# Altium schematic sheet POWER_RK806.SchDoc (part 1 of 2)
size 840 x 594 mm; SheetNumber: 14; SheetTotal: 23
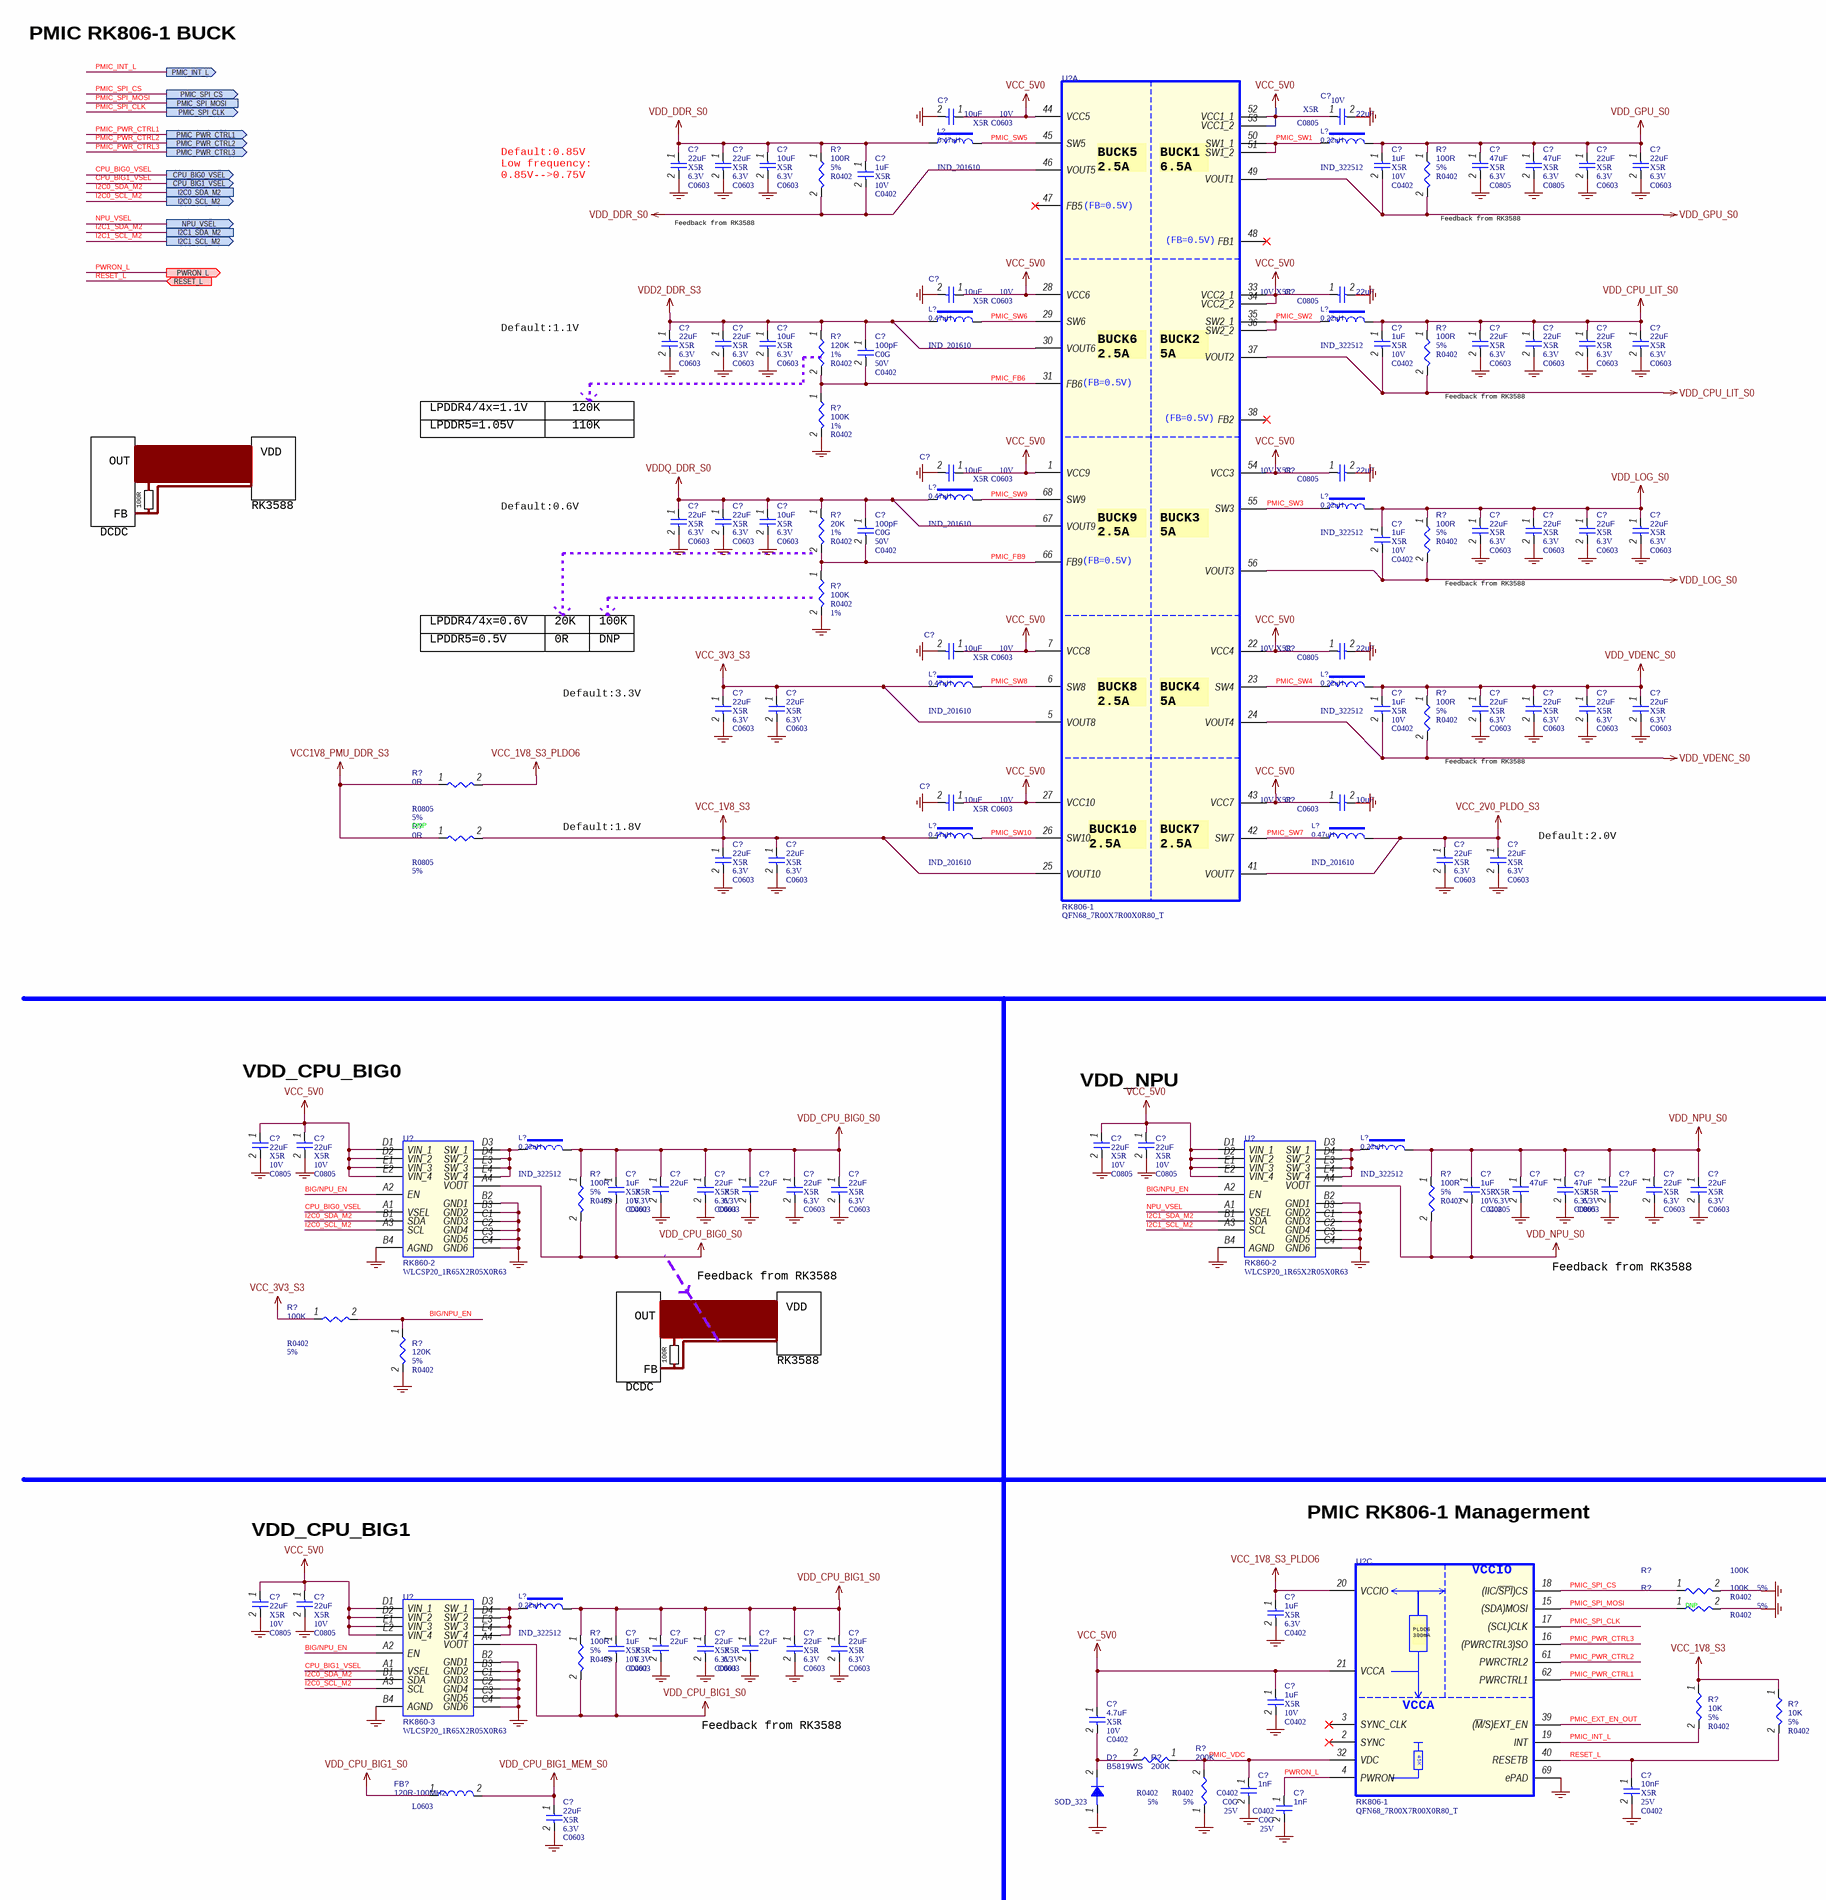
[diagram p0: POWER_RK806.SchDoc, left]
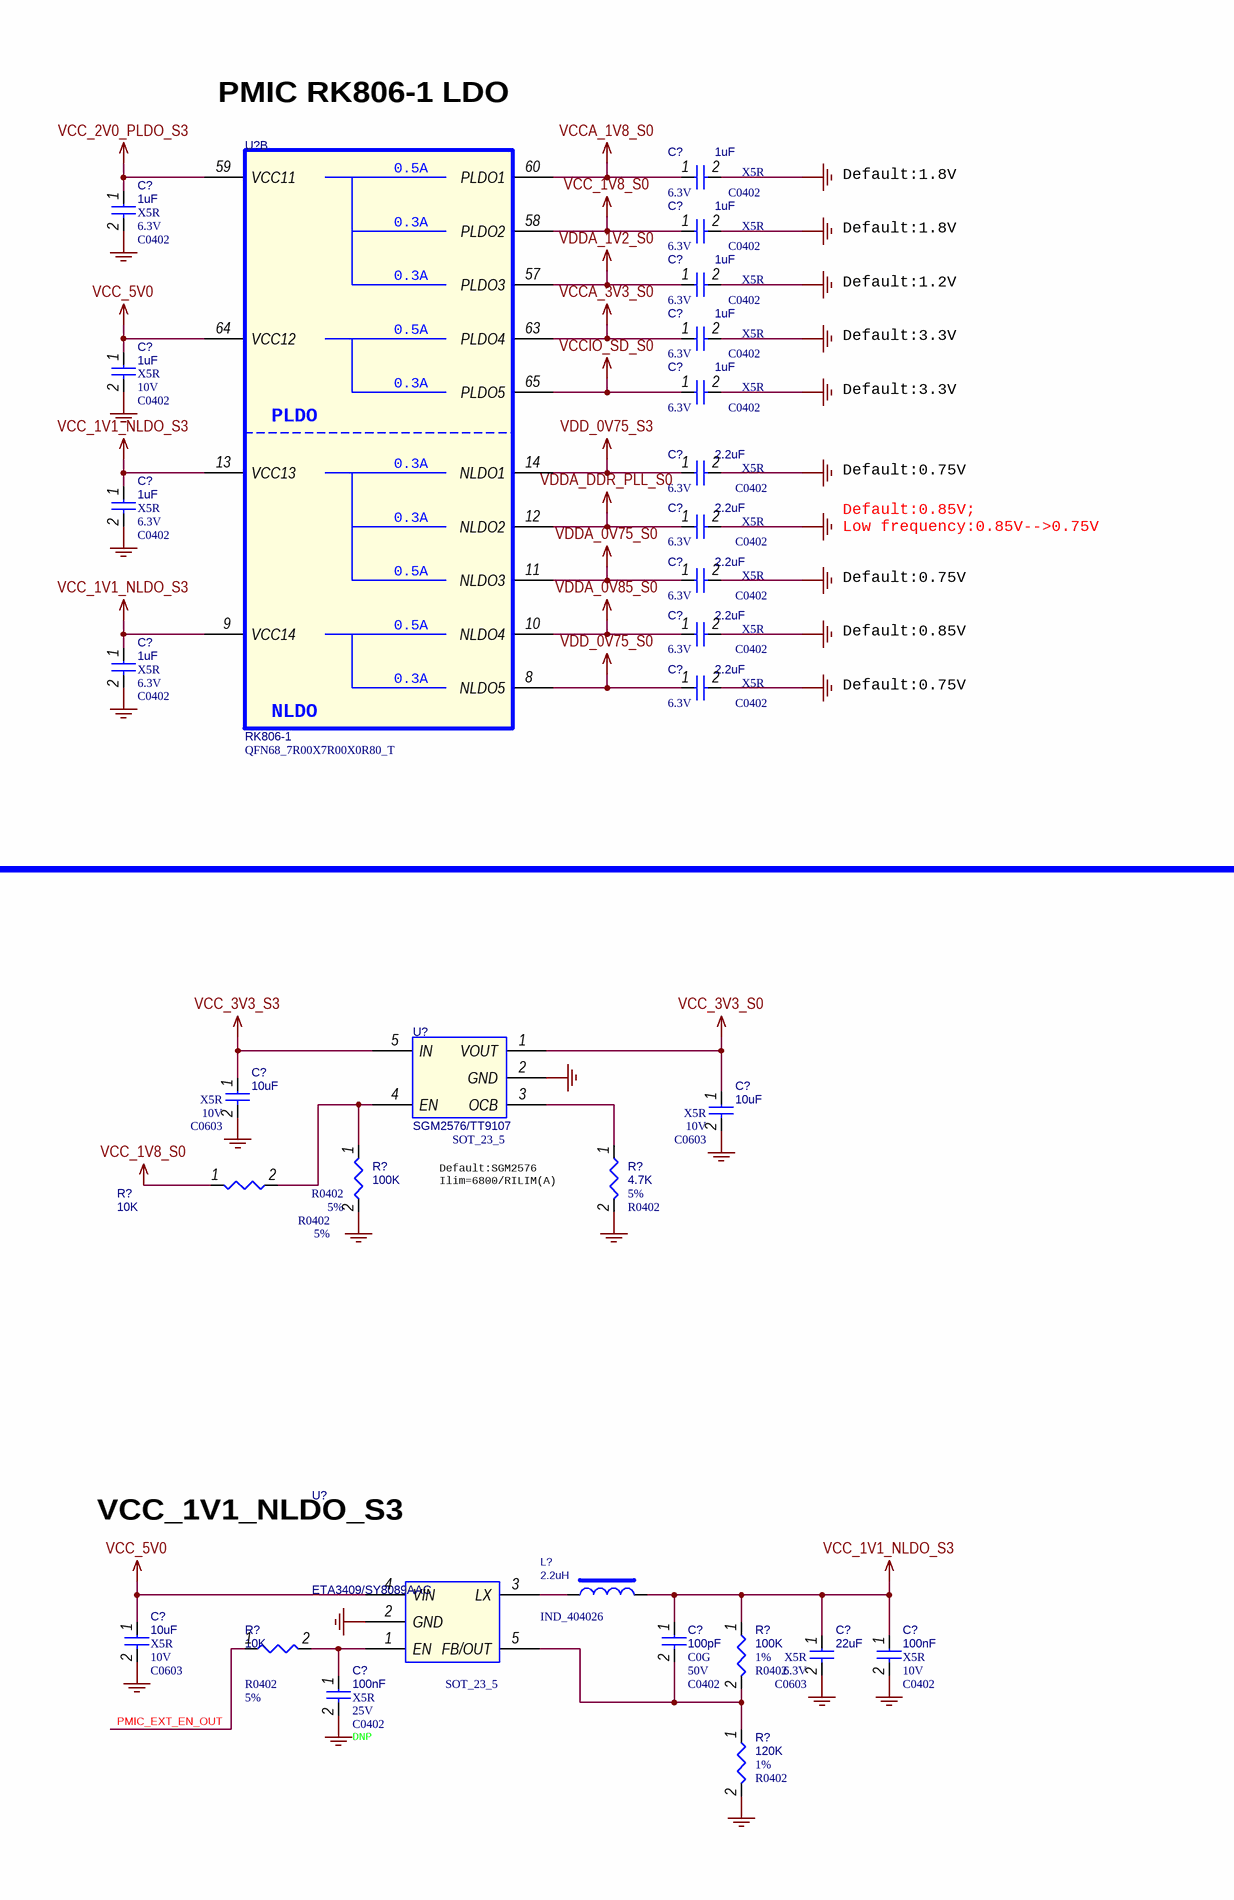
[diagram p1: POWER_RK806.SchDoc, right]

## Parts
(Parts that share a designator on the sheet are numbered #1, #2 ... from top to bottom, then left to right.)
C?#1  10uF  Dielectric: X5R  Voltage: 10V  [C0603]
C?#2  22uF  Dielectric: X5R  Voltage: 10V  [C0805]
C?#3  22uF  Dielectric: X5R  Voltage: 6.3V  [C0603]
C?#4  22uF  Dielectric: X5R  Voltage: 6.3V  [C0603]
C?#5  10uF  Dielectric: X5R  Voltage: 6.3V  [C0603]
C?#6  1uF  Dielectric: X5R  Voltage: 10V  [C0402]
C?#7  47uF  Dielectric: X5R  Voltage: 6.3V  [C0805]
C?#8  47uF  Dielectric: X5R  Voltage: 6.3V  [C0805]
C?#9  22uF  Dielectric: X5R  Voltage: 6.3V  [C0603]
C?#10  22uF  Dielectric: X5R  Voltage: 6.3V  [C0603]
C?#11  1uF  Dielectric: X5R  Voltage: 10V  [C0402]
C?#12  10uF  Dielectric: X5R  Voltage: 10V  [C0603]
C?#13  22uF  Dielectric: X5R  Voltage: 10V  [C0805]
C?#14  1uF  Dielectric: X5R  Voltage: 6.3V  [C0402]
C?#15  1uF  Dielectric: X5R  Voltage: 6.3V  [C0402]
C?#16  1uF  Dielectric: X5R  Voltage: 6.3V  [C0402]
C?#17  22uF  Dielectric: X5R  Voltage: 6.3V  [C0603]
C?#18  22uF  Dielectric: X5R  Voltage: 6.3V  [C0603]
C?#19  10uF  Dielectric: X5R  Voltage: 6.3V  [C0603]
C?#20  1uF  Dielectric: X5R  Voltage: 10V  [C0402]
C?#21  22uF  Dielectric: X5R  Voltage: 6.3V  [C0603]
C?#22  22uF  Dielectric: X5R  Voltage: 6.3V  [C0603]
C?#23  22uF  Dielectric: X5R  Voltage: 6.3V  [C0603]
C?#24  22uF  Dielectric: X5R  Voltage: 6.3V  [C0603]
C?#25  100pF  Dielectric: C0G  Voltage: 50V  [C0402]
C?#26  1uF  Dielectric: X5R  Voltage: 6.3V  [C0402]
C?#27  1uF  Dielectric: X5R  Voltage: 6.3V  [C0402]
C?#28  1uF  Dielectric: X5R  Voltage: 10V  [C0402]
C?#29  1uF  Dielectric: X5R  Voltage: 6.3V  [C0402]
C?#30  10uF  Dielectric: X5R  Voltage: 10V  [C0603]
C?#31  22uF  Dielectric: X5R  Voltage: 10V  [C0805]
C?#32  2.2uF  Dielectric: X5R  Voltage: 6.3V  [C0402]
C?#33  1uF  Dielectric: X5R  Voltage: 6.3V  [C0402]
C?#34  22uF  Dielectric: X5R  Voltage: 6.3V  [C0603]
C?#35  22uF  Dielectric: X5R  Voltage: 6.3V  [C0603]
C?#36  10uF  Dielectric: X5R  Voltage: 6.3V  [C0603]
C?#37  2.2uF  Dielectric: X5R  Voltage: 6.3V  [C0402]
C?#38  100pF  Dielectric: C0G  Voltage: 50V  [C0402]
C?#39  22uF  Dielectric: X5R  Voltage: 6.3V  [C0603]
C?#40  22uF  Dielectric: X5R  Voltage: 6.3V  [C0603]
C?#41  22uF  Dielectric: X5R  Voltage: 6.3V  [C0603]
C?#42  22uF  Dielectric: X5R  Voltage: 6.3V  [C0603]
C?#43  1uF  Dielectric: X5R  Voltage: 10V  [C0402]
C?#44  2.2uF  Dielectric: X5R  Voltage: 6.3V  [C0402]
C?#45  2.2uF  Dielectric: X5R  Voltage: 6.3V  [C0402]
C?#46  1uF  Dielectric: X5R  Voltage: 6.3V  [C0402]
C?#47  2.2uF  Dielectric: X5R  Voltage: 6.3V  [C0402]
C?#48  10uF  Dielectric: X5R  Voltage: 10V  [C0603]
C?#49  22uF  Dielectric: X5R  Voltage: 10V  [C0805]
C?#50  22uF  Dielectric: X5R  Voltage: 6.3V  [C0603]
C?#51  22uF  Dielectric: X5R  Voltage: 6.3V  [C0603]
C?#52  1uF  Dielectric: X5R  Voltage: 10V  [C0402]
C?#53  22uF  Dielectric: X5R  Voltage: 6.3V  [C0603]
C?#54  22uF  Dielectric: X5R  Voltage: 6.3V  [C0603]
C?#55  22uF  Dielectric: X5R  Voltage: 6.3V  [C0603]
C?#56  22uF  Dielectric: X5R  Voltage: 6.3V  [C0603]
C?#57  10uF  Dielectric: X5R  Voltage: 10V  [C0603]
C?#58  10uF  Dielectric: X5R  Voltage: 10V  [C0603]
C?#59  22uF  Dielectric: X5R  Voltage: 6.3V  [C0603]
C?#60  22uF  Dielectric: X5R  Voltage: 6.3V  [C0603]
C?#61  22uF  Dielectric: X5R  Voltage: 6.3V  [C0603]
C?#62  22uF  Dielectric: X5R  Voltage: 6.3V  [C0603]
C?#63  10uF  Dielectric: X5R  Voltage: 10V  [C0603]
C?#64  10uF  Dielectric: X5R  Voltage: 10V  [C0603]
C?#65  22uF  Dielectric: X5R  Voltage: 10V  [C0805]
C?#66  22uF  Dielectric: X5R  Voltage: 10V  [C0805]
C?#67  22uF  Dielectric: X5R  Voltage: 10V  [C0805]
C?#68  22uF  Dielectric: X5R  Voltage: 10V  [C0805]
C?#69  1uF  Dielectric: X5R  Voltage: 10V  [C0402]
C?#70  22uF  Dielectric: X5R  Voltage: 6.3V  [C0603]
C?#71  22uF  Dielectric: X5R  Voltage: 6.3V  [C0603]
C?#72  22uF  Dielectric: X5R  Voltage: 6.3V  [C0603]
C?#73  22uF  Dielectric: X5R  Voltage: 6.3V  [C0603]
C?#74  22uF  Dielectric: X5R  Voltage: 6.3V  [C0603]
C?#75  1uF  Dielectric: X5R  Voltage: 10V  [C0402]
C?#76  47uF  Dielectric: X5R  Voltage: 6.3V  [C0805]
C?#77  47uF  Dielectric: X5R  Voltage: 6.3V  [C0805]
C?#78  22uF  Dielectric: X5R  Voltage: 6.3V  [C0603]
C?#79  22uF  Dielectric: X5R  Voltage: 6.3V  [C0603]
C?#80  22uF  Dielectric: X5R  Voltage: 6.3V  [C0603]
C?#81  10uF  Dielectric: X5R  Voltage: 10V  [C0603]
C?#82  100pF  Dielectric: C0G  Voltage: 50V  [C0402]
C?#83  22uF  Dielectric: X5R  Voltage: 6.3V  [C0603]
C?#84  100nF  Dielectric: X5R  Voltage: 10V  [C0402]
C?#85  100nF  Dielectric: X5R  Voltage: 25V  Option: DNP  [C0402]
C?#86  22uF  Dielectric: X5R  Voltage: 10V  [C0805]
C?#87  22uF  Dielectric: X5R  Voltage: 10V  [C0805]
C?#88  1uF  Dielectric: X5R  Voltage: 6.3V  [C0402]
C?#89  1uF  Dielectric: X5R  Voltage: 10V  [C0402]
C?#90  22uF  Dielectric: X5R  Voltage: 6.3V  [C0603]
C?#91  22uF  Dielectric: X5R  Voltage: 6.3V  [C0603]
C?#92  22uF  Dielectric: X5R  Voltage: 6.3V  [C0603]
C?#93  22uF  Dielectric: X5R  Voltage: 6.3V  [C0603]
C?#94  22uF  Dielectric: X5R  Voltage: 6.3V  [C0603]
C?#95  1uF  Dielectric: X5R  Voltage: 10V  [C0402]
C?#96  4.7uF  Dielectric: X5R  Voltage: 10V  [C0402]
C?#97  1nF  Dielectric: C0G  Voltage: 25V  [C0402]
C?#98  10nF  Dielectric: X5R  Voltage: 25V  [C0402]
C?#99  1nF  Dielectric: C0G  Voltage: 25V  [C0402]
C?#100  22uF  Dielectric: X5R  Voltage: 6.3V  [C0603]
D?  B5819WS  [SOD_323]
FB?  120R-100MHz  [L0603]
L?#1  0.47uH  [IND_201610]
L?#2  0.22uH  [IND_322512]
L?#3  0.47uH  [IND_201610]
L?#4  0.22uH  [IND_322512]
L?#5  0.47uH  [IND_201610]
L?#6  0.22uH  [IND_322512]
L?#7  0.47uH  [IND_201610]
L?#8  0.22uH  [IND_322512]
L?#9  0.47uH  [IND_201610]
L?#10  0.47uH  [IND_201610]
L?#11  0.22uH  [IND_322512]
L?#12  0.22uH  [IND_322512]
L?#13  2.2uH  [IND_404026]
L?#14  0.22uH  [IND_322512]
R?#1  100R  Tolerance: 5%  [R0402]
R?#2  100R  Tolerance: 5%  [R0402]
R?#3  120K  Tolerance: 1%  [R0402]
R?#4  100R  Tolerance: 5%  [R0402]
R?#5  100K  Tolerance: 1%  [R0402]
R?#6  20K  Tolerance: 1%  [R0402]
R?#7  100R  Tolerance: 5%  [R0402]
R?#8  100K  Tolerance: 1%  [R0402]
R?#9  100R  Tolerance: 5%  [R0402]
R?#10  0R  Tolerance: 5%  PCB Footprint: R0805  OPTION: DNP  [R0402]
R?#11  0R  Tolerance: 5%  PCB Footprint: R0805  [R0402]
R?#12  100K  Tolerance: 5%  [R0402]
R?#13  4.7K  Tolerance: 5%  [R0402]
R?#14  10K  Tolerance: 5%  [R0402]
R?#15  100R  Tolerance: 5%  [R0402]
R?#16  100R  Tolerance: 5%  [R0402]
R?#17  100K  Tolerance: 1%  [R0402]
R?#18  10K  Tolerance: 5%  [R0402]
R?#19  120K  Tolerance: 1%  [R0402]
R?#20  100K  Tolerance: 5%  [R0402]
R?#21  120K  Tolerance: 5%  [R0402]
R?#22  100K  Tolerance: 5%  [R0402]
R?#23  100K  Tolerance: 5%  option: DNP  [R0402]
R?#24  100R  Tolerance: 5%  [R0402]
R?#25  10K  Tolerance: 5%  [R0402]
R?#26  10K  Tolerance: 5%  [R0402]
R?#27  200K  Tolerance: 5%  [R0402]
R?#28  200K  Tolerance: 5%  [R0402]
U?#1  RK806-1  [QFN68_7R00X7R00X0R80_T]  (part A of 3)
U?#2  RK806-1  [QFN68_7R00X7R00X0R80_T]  (part B of 3)
U?#3  SGM2576/TT9107  [SOT_23_5]
U?#4  RK860-2  PCB Footprint: WLCSP20_1R65X2R05X0R63  [WLCSP-20]
U?#5  RK860-2  PCB Footprint: WLCSP20_1R65X2R05X0R63  [WLCSP-20]
U?#6  ETA3409/SY8089AAC  [SOT_23_5]
U?#7  RK806-1  [QFN68_7R00X7R00X0R80_T]  (part C of 3)
U?#8  RK860-3  PCB Footprint: WLCSP20_1R65X2R05X0R63  [WLCSP-20]

## Ports
CPU_BIG0_VSEL (out, see RK3588_OSC_PLL[4B]), CPU_BIG1_VSEL (out, see RK3588_OSC_PLL[3C]), I2C0_SCL_M2 (out, see RK3588_OSC_PLL[3C]), I2C0_SDA_M2 (see RK3588_OSC_PLL[3C]), I2C1_SCL_M2 (out, see RK3588_OSC_PLL[3C]), I2C1_SDA_M2 (see RK3588_OSC_PLL[3C]), NPU_VSEL (out, see RK3588_OSC_PLL[3C]), PMIC_INT_L (out, see RK3588_OSC_PLL[4B]), PMIC_PWR_CTRL1 (out, see RK3588_OSC_PLL[4B]), PMIC_PWR_CTRL2 (out, see RK3588_OSC_PLL[4C]), PMIC_PWR_CTRL3 (out, see RK3588_OSC_PLL[4C]), PMIC_SPI_CLK (out, see RK3588_OSC_PLL[4B]), PMIC_SPI_CS (out, see RK3588_OSC_PLL[4B]), PMIC_SPI_MOSI (see RK3588_OSC_PLL[4B]), PWRON_L (out, see BUTTON[2C]), RESET_L (in, see BUTTON[2B], RK3588_OSC_PLL[4A])

## Nets
GND: C?#1.2 C?#2.2 C?#3.2 C?#4.2 C?#5.2 C?#7.2 C?#8.2 C?#9.2 C?#10.2 C?#12.2 C?#13.2 C?#14.2 C?#15.2 C?#16.2 C?#17.2 C?#18.2 C?#19.2 C?#21.2 C?#22.2 C?#23.2 C?#24.2 C?#26.2 C?#27.2 C?#28.2 C?#29.2 C?#30.2 C?#31.2 C?#32.2 C?#33.2 C?#34.2 C?#35.2 C?#36.2 C?#37.2 C?#39.2 C?#40.2 C?#41.2 C?#42.2 C?#44.2 C?#45.2 C?#46.2 C?#47.2 C?#48.2 C?#49.2 C?#50.2 C?#51.2 C?#53.2 C?#54.2 C?#55.2 C?#56.2 C?#57.2 C?#58.2 C?#59.2 C?#60.2 C?#61.2 C?#62.2 C?#63.2 C?#64.2 C?#65.2 C?#66.2 C?#67.2 C?#68.2 C?#70.2 C?#71.2 C?#72.2 C?#73.2 C?#74.2 C?#76.2 C?#77.2 C?#78.2 C?#79.2 C?#80.2 C?#81.2 C?#83.2 C?#84.2 C?#85.2 C?#86.2 C?#87.2 C?#88.2 C?#90.2 C?#91.2 C?#92.2 C?#93.2 C?#94.2 C?#95.2 C?#97.2 C?#98.2 C?#99.2 C?#100.2 D?.1(A) R?#5.2 R?#8.2 R?#12.2 R?#13.2 R?#19.2 R?#21.2 R?#22.2 R?#23.2 R?#28.1 U?#3.2(GND) U?#4.B2(GND1) U?#4.B3(GND2) U?#4.B4(AGND) U?#4.C1(GND3) U?#4.C2(GND4) U?#4.C3(GND5) U?#4.C4(GND6) U?#5.B2(GND1) U?#5.B3(GND2) U?#5.B4(AGND) U?#5.C1(GND3) U?#5.C2(GND4) U?#5.C3(GND5) U?#5.C4(GND6) U?#6.2(GND) U?#7.69(ePAD) U?#8.B2(GND1) U?#8.B3(GND2) U?#8.B4(AGND) U?#8.C1(GND3) U?#8.C2(GND4) U?#8.C3(GND5) U?#8.C4(GND6)
VCC1V8_PMU_DDR_S3: R?#10.1 R?#11.1
VCC_1V1_NLDO_S3: C?#33.1 C?#46.1 C?#82.1 C?#83.1 C?#84.1 L?#13.2 R?#17.1 U?#2.9(VCC14) U?#2.13(VCC13)
VCC_1V8_S0: C?#16.1 R?#14.1 U?#2.58(PLDO2)
VCC_1V8_S3: C?#59.1 C?#60.1 L?#9.1 R?#11.2 R?#25.1 R?#26.1 U?#1.25(VOUT10)
VCC_1V8_S3_PLDO6: C?#88.1 R?#10.2 U?#7.20(VCCIO)
VCC_2V0_PLDO_S3: C?#15.1 C?#61.1 C?#62.1 L?#10.2 U?#1.41(VOUT7) U?#2.59(VCC11)
VCC_3V3_S0: C?#64.1 U?#3.1(VOUT)
VCC_3V3_S3: C?#50.1 C?#51.1 C?#63.1 L?#7.1 R?#20.1 U?#1.5(VOUT8) U?#3.5(IN)
VCC_5V0: C?#1.1 C?#2.1 C?#12.1 C?#13.1 C?#28.1 C?#30.1 C?#31.1 C?#48.1 C?#49.1 C?#57.1 C?#58.1 C?#65.1 C?#66.1 C?#67.1 C?#68.1 C?#81.1 C?#86.1 C?#87.1 C?#95.1 C?#96.1 U?#1.1(VCC9) U?#1.7(VCC8) U?#1.22(VCC4) U?#1.27(VCC10) U?#1.28(VCC6) U?#1.33(VCC2_1) U?#1.34(VCC2_2) U?#1.43(VCC7) U?#1.44(VCC5) U?#1.52(VCC1_1) U?#1.53(VCC1_2) U?#1.54(VCC3) U?#2.64(VCC12) U?#4.D1(VIN_1) U?#4.D2(VIN_2) U?#4.E1(VIN_3) U?#4.E2(VIN_4) U?#5.D1(VIN_1) U?#5.D2(VIN_2) U?#5.E1(VIN_3) U?#5.E2(VIN_4) U?#6.4(VIN) U?#7.21(VCCA) U?#8.D1(VIN_1) U?#8.D2(VIN_2) U?#8.E1(VIN_3) U?#8.E2(VIN_4)
VCCA_1V8_S0: C?#14.1 U?#2.60(PLDO1)
VCCA_3V3_S0: C?#27.1 U?#2.63(PLDO4)
VCCIO_SD_S0: C?#29.1 U?#2.65(PLDO5)
VDD2_DDR_S3: C?#17.1 C?#18.1 C?#19.1 C?#25.1 L?#3.1 R?#3.1 U?#1.30(VOUT6)
VDD_0V75_S0: C?#47.1 U?#2.8(NLDO5)
VDD_0V75_S3: C?#32.1 U?#2.14(NLDO1)
VDD_CPU_BIG0_S0: C?#69.1 C?#69.2 C?#70.1 C?#71.1 C?#72.1 C?#73.1 C?#74.1 L?#11.2 R?#15.1 R?#15.2 U?#4.A4(VOUT)
VDD_CPU_BIG1_MEM_S0: C?#100.1 FB?.2
VDD_CPU_BIG1_S0: C?#89.1 C?#89.2 C?#90.1 C?#91.1 C?#92.1 C?#93.1 C?#94.1 FB?.1 L?#14.2 R?#24.1 R?#24.2 U?#8.A4(VOUT)
VDD_CPU_LIT_S0: C?#20.1 C?#20.2 C?#21.1 C?#22.1 C?#23.1 C?#24.1 L?#4.2 R?#4.1 R?#4.2 U?#1.37(VOUT2)
VDD_DDR_S0: C?#3.1 C?#4.1 C?#5.1 C?#11.1 C?#11.2 L?#1.1 R?#1.1 R?#1.2 U?#1.46(VOUT5)
VDD_GPU_S0: C?#6.1 C?#6.2 C?#7.1 C?#8.1 C?#9.1 C?#10.1 L?#2.2 R?#2.1 R?#2.2 U?#1.49(VOUT1)
VDD_LOG_S0: C?#39.1 C?#40.1 C?#41.1 C?#42.1 C?#43.1 C?#43.2 L?#6.2 R?#7.1 R?#7.2 U?#1.56(VOUT3)
VDD_NPU_S0: C?#75.1 C?#75.2 C?#76.1 C?#77.1 C?#78.1 C?#79.1 C?#80.1 L?#12.2 R?#16.1 R?#16.2 U?#5.A4(VOUT)
VDD_VDENC_S0: C?#52.1 C?#52.2 C?#53.1 C?#54.1 C?#55.1 C?#56.1 L?#8.2 R?#9.1 R?#9.2 U?#1.24(VOUT4)
VDDA_0V75_S0: C?#44.1 U?#2.11(NLDO3)
VDDA_0V85_S0: C?#45.1 U?#2.10(NLDO4)
VDDA_1V2_S0: C?#26.1 U?#2.57(PLDO3)
VDDA_DDR_PLL_S0: C?#37.1 U?#2.12(NLDO2)
VDDQ_DDR_S0: C?#34.1 C?#35.1 C?#36.1 C?#38.1 L?#5.1 R?#6.1 U?#1.67(VOUT9)
BIG/NPU_EN: R?#20.2 R?#21.1 U?#4.A2(EN) U?#5.A2(EN) U?#8.A2(EN)
CPU_BIG0_VSEL: U?#4.A1(VSEL) ; port CPU_BIG0_VSEL
CPU_BIG1_VSEL: U?#8.A1(VSEL) ; port CPU_BIG1_VSEL
I2C0_SCL_M2: U?#4.A3(SCL) U?#8.A3(SCL) ; port I2C0_SCL_M2
I2C0_SDA_M2: U?#4.B1(SDA) U?#8.B1(SDA) ; port I2C0_SDA_M2
I2C1_SCL_M2: U?#5.A3(SCL) ; port I2C1_SCL_M2
I2C1_SDA_M2: U?#5.B1(SDA) ; port I2C1_SDA_M2
NPU_VSEL: U?#5.A1(VSEL) ; port NPU_VSEL
PMIC_EXT_EN_OUT: R?#18.1 U?#7.39((~{M}/S)EXT_EN)
PMIC_FB6: C?#25.2 R?#3.2 R?#5.1 U?#1.31(FB6)
PMIC_FB9: C?#38.2 R?#6.2 R?#8.1 U?#1.66(FB9)
PMIC_INT_L: R?#25.2 U?#7.19(INT) ; port PMIC_INT_L
PMIC_PWR_CTRL1: U?#7.62(PWRCTRL1) ; port PMIC_PWR_CTRL1
PMIC_PWR_CTRL2: U?#7.61(PWRCTRL2) ; port PMIC_PWR_CTRL2
PMIC_PWR_CTRL3: U?#7.16((PWRCTRL3)SO) ; port PMIC_PWR_CTRL3
PMIC_SPI_CLK: U?#7.17((SCL)CLK) ; port PMIC_SPI_CLK
PMIC_SPI_CS: R?#22.1 U?#7.18((IIC/~{SPI})CS) ; port PMIC_SPI_CS
PMIC_SPI_MOSI: R?#23.1 U?#7.15((SDA)MOSI) ; port PMIC_SPI_MOSI
PMIC_SW1: L?#2.1 U?#1.50(SW1_1) U?#1.51(SW1_2)
PMIC_SW2: L?#4.1 U?#1.35(SW2_1) U?#1.36(SW2_2)
PMIC_SW3: L?#6.1 U?#1.55(SW3)
PMIC_SW4: L?#8.1 U?#1.23(SW4)
PMIC_SW5: L?#1.2 U?#1.45(SW5)
PMIC_SW6: L?#3.2 U?#1.29(SW6)
PMIC_SW7: L?#10.1 U?#1.42(SW7)
PMIC_SW8: L?#7.2 U?#1.6(SW8)
PMIC_SW9: L?#5.2 U?#1.68(SW9)
PMIC_SW10: L?#9.2 U?#1.26(SW10)
PMIC_VDC: C?#97.1 R?#27.1 R?#28.2 U?#7.32(VDC)
PWRON_L: C?#99.1 U?#7.4(PWRON) ; port PWRON_L
RESET_L: C?#98.1 R?#26.2 U?#7.40(RESETB) ; port RESET_L
NetC?#82_2: C?#82.2 R?#17.2 R?#19.1 U?#6.5(FB/OUT)
NetC?#85_1: C?#85.1 R?#18.2 U?#6.1(EN)
NetC?#96_2: C?#96.2 D?.2(K) R?#27.2
NetL?#11_1: L?#11.1 U?#4.D3(SW_1) U?#4.D4(SW_2) U?#4.E3(SW_3) U?#4.E4(SW_4)
NetL?#12_1: L?#12.1 U?#5.D3(SW_1) U?#5.D4(SW_2) U?#5.E3(SW_3) U?#5.E4(SW_4)
NetL?#13_1: L?#13.1 U?#6.3(LX)
NetL?#14_1: L?#14.1 U?#8.D3(SW_1) U?#8.D4(SW_2) U?#8.E3(SW_3) U?#8.E4(SW_4)
NetR?#12_1: R?#12.1 R?#14.2 U?#3.4(EN)
NetR?#13_1: R?#13.1 U?#3.3(OCB)

Not connected (* = marked no-connect by the designer): U?#1 38(FB2)* 47(FB5)* 48(FB1)*; U?#7 2(SYNC)* 3(SYNC_CLK)*

## Notes on the sheet
- PMIC RK806-1 BUCK
- Default:0.85V
  Low frequency:
  0.85V-->0.75V
- Feedback from RK3588
- PMIC RK806-1 LDO
- Default:1.8V
- Default:1.1V
- Default:1.2V
- LPDDR4/4x=1.1V
- LPDDR5=1.05V
- 110K
- 120K
- Default:3.3V
- OUT
- VDD
- FB
- 100R
- RK3588
- Default:0.6V
- Default:0.75V
- Default:0.85V;
  Low frequency:0.85V-->0.75V
- DCDC
- Default:0.85V
- LPDDR5=0.5V
- LPDDR4/4x=0.6V
- 0R
- 20K
- 100K
- DNP
- Default:2.0V
- Default:SGM2576
  Ilim=6800/RILIM(A)
- VDD_CPU_BIG0
- VDD_NPU
- VCC_1V1_NLDO_S3
- VDD_CPU_BIG1
- PMIC RK806-1 Managerment
- 594x841
- Формат А1
- (in symbol PMIC_RK806, part A) BUCK5 / 2.5A; BUCK1 / 6.5A; (FB=0.5V); BUCK6 / 2.5A; BUCK2 / 5A; BUCK9 / 2.5A; BUCK3 / 5A; BUCK8 / 2.5A; BUCK4 / 5A; BUCK10 / 2.5A; BUCK7 / 2.5A
- (in symbol PMIC_RK806, part B) 0.5A; 0.3A; PLDO; NLDO
- (in symbol PMIC_RK806, part C) PLDO6 / 300mA; 45K